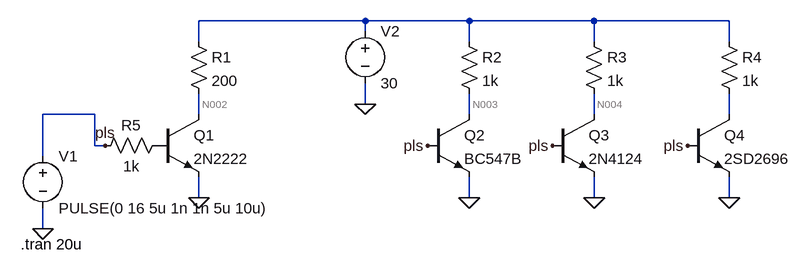
[diagram p0: schematic Draft1.asc]
Draft1.asc, the LTspice schematic file:
Version 4
SHEET 1 1076 680
WIRE 416 -32 160 -32
WIRE 576 -32 416 -32
WIRE 768 -32 576 -32
WIRE 976 -32 768 -32
WIRE 416 -16 416 -32
WIRE 160 0 160 -32
WIRE 576 0 576 -32
WIRE 768 0 768 -32
WIRE 976 0 976 -32
WIRE 416 96 416 64
WIRE 0 112 -80 112
WIRE 160 112 160 80
WIRE 576 112 576 80
WIRE 768 112 768 80
WIRE 976 112 976 80
WIRE 0 160 0 112
WIRE 16 160 0 160
WIRE -80 176 -80 112
WIRE 160 240 160 208
WIRE 576 240 576 208
WIRE 768 240 768 208
WIRE 976 240 976 208
WIRE -80 288 -80 256
FLAG 160 240 0
FLAG 416 96 0
FLAG -80 288 0
FLAG 576 240 0
FLAG 16 160 pls
FLAG 512 160 pls
FLAG 768 240 0
FLAG 704 160 pls
FLAG 976 240 0
FLAG 912 160 pls
SYMBOL npn 96 112 R0
SYMATTR InstName Q1
SYMATTR Value 2N2222
SYMBOL res 144 -16 R0
SYMATTR InstName R1
SYMATTR Value 200
SYMBOL voltage -80 160 R0
WINDOW 123 0 0 Left 0
WINDOW 39 0 0 Left 0
SYMATTR InstName V1
SYMATTR Value PULSE(0 16 5u 1n 1n 5u 10u)
SYMBOL voltage 416 -32 R0
WINDOW 123 0 0 Left 0
WINDOW 39 0 0 Left 0
SYMATTR InstName V2
SYMATTR Value 30
SYMBOL npn 512 112 R0
SYMATTR InstName Q2
SYMATTR Value BC547B
SYMBOL res 560 -16 R0
SYMATTR InstName R2
SYMATTR Value 1k
SYMBOL npn 704 112 R0
SYMATTR InstName Q3
SYMATTR Value 2N4124
SYMBOL res 752 -16 R0
SYMATTR InstName R3
SYMATTR Value 1k
SYMBOL npn 912 112 R0
SYMATTR InstName Q4
SYMATTR Value 2SD2696
SYMBOL res 960 -16 R0
SYMATTR InstName R4
SYMATTR Value 1k
SYMBOL res 112 144 R90
WINDOW 0 0 56 VBottom 2
WINDOW 3 32 56 VTop 2
SYMATTR InstName R5
SYMATTR Value 1k
TEXT -114 312 Left 2 !.tran 20u

The netlist it stands for:
* Draft1.asc
Q1 N002 P001 0 0 2N2222
R1 N001 N002 200
V1 pls 0 PULSE(0 16 5u 1n 1n 5u 10u)
V2 N001 0 30
Q2 N003 pls 0 0 BC547B
R2 N001 N003 1k
Q3 N004 pls 0 0 2N4124
R3 N001 N004 1k
Q4 N005 pls 0 0 2SD2696
R4 N001 N005 1k
R5 P001 pls 1k
.model NPN NPN
.model PNP PNP
.lib standard.bjt
.tran 20u
.backanno
.end

* Results of the author's LTspice run, read from the files saved beside the schematic
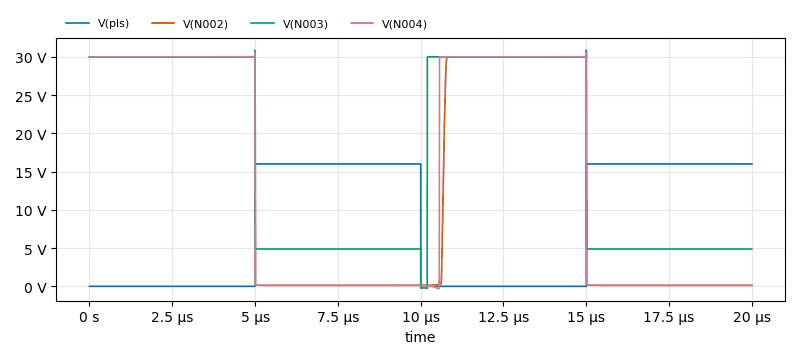
[diagram p1: Transient Analysis of Draft1.asc, plotted from the saved traces]
* Transient Analysis, 1 run:
*   V(pls): min 0 V, max 16 V, average 8 V, rms 11.31 V, last 16 V
*   V(N002): min 124.3 mV, max 30.18 V, average 14.06 V, rms 20.45 V, last 130.2 mV
*   V(N003): min -273.3 mV, max 30.85 V, average 17.14 V, rms 21.28 V, last 4.884 V
*   V(N004): min -321.7 mV, max 30.59 V, average 14.22 V, rms 20.61 V, last 120.9 mV